# EAGLE design unoedge (EAGLE 6.5.0)
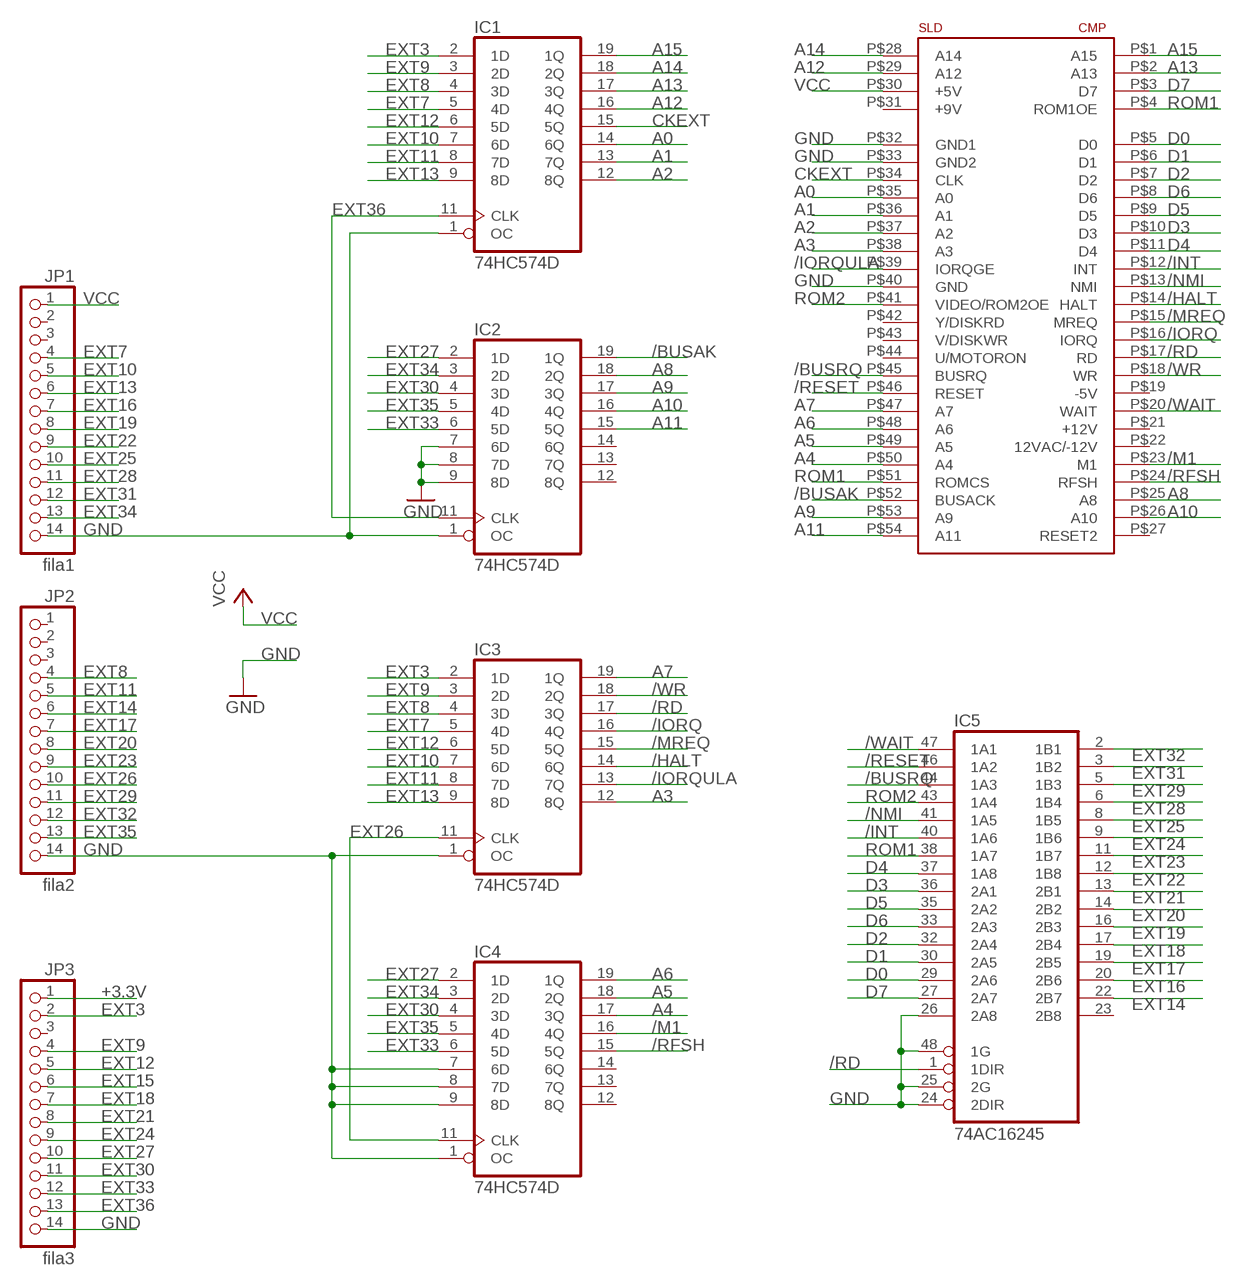
[diagram p0: schematic, sheet 1]

## Parts
IC1  74HC574D  [SO20W]
IC2  74HC574D  [SO20W]
IC3  74HC574D  [SO20W]
IC4  74HC574D  [SO20W]
IC5  74AC16245  [SSOP48DL]
JP1  fila1  PINHD-1X14  [1X14]
JP2  fila2  PINHD-1X14  [1X14]
JP3  fila3  PINHD-1X14  [1X14]
U$2  CONECTOR_EDGE_LADO_SPECTRUM  [CONECTOR_LADO_SPECTRUM]

## Nets
+3.3V: JP3.1
/BUSAK: IC2.19(1Q) U$2.P$52(BUSACK)
/BUSRQ: IC5.44(1A3) U$2.P$45(BUSRQ)
/HALT: IC3.14(6Q) U$2.P$14(HALT)
/INT: IC5.40(1A6) U$2.P$12(INT)
/IORQ: IC3.16(4Q) U$2.P$16(IORQ)
/IORQULA: IC3.13(7Q) U$2.P$39(IORQGE)
/M1: IC4.16(4Q) U$2.P$23(M1)
/MREQ: IC3.15(5Q) U$2.P$15(MREQ)
/NMI: IC5.41(1A5) U$2.P$13(NMI)
/RD: IC3.17(3Q) IC5.1(1DIR) U$2.P$17(RD)
/RESET: IC5.46(1A2) U$2.P$46(RESET)
/RFSH: IC4.15(5Q) U$2.P$24(RFSH)
/WAIT: IC5.47(1A1) U$2.P$20(WAIT)
/WR: IC3.18(2Q) U$2.P$18(WR)
A0: IC1.14(6Q) U$2.P$35(A0)
A1: IC1.13(7Q) U$2.P$36(A1)
A2: IC1.12(8Q) U$2.P$37(A2)
A3: IC3.12(8Q) U$2.P$38(A3)
A4: IC4.17(3Q) U$2.P$50(A4)
A5: IC4.18(2Q) U$2.P$49(A5)
A6: IC4.19(1Q) U$2.P$48(A6)
A7: IC3.19(1Q) U$2.P$47(A7)
A8: IC2.18(2Q) U$2.P$25(A8)
A9: IC2.17(3Q) U$2.P$53(A9)
A10: IC2.16(4Q) U$2.P$26(A10)
A11: IC2.15(5Q) U$2.P$54(A11)
A12: IC1.16(4Q) U$2.P$29(A12)
A13: IC1.17(3Q) U$2.P$2(A13)
A14: IC1.18(2Q) U$2.P$28(A14)
A15: IC1.19(1Q) U$2.P$1(A15)
CKEXT: IC1.15(5Q) U$2.P$34(CLK)
D0: IC5.29(2A6) U$2.P$5(D0)
D1: IC5.30(2A5) U$2.P$6(D1)
D2: IC5.32(2A4) U$2.P$7(D2)
D3: IC5.36(2A1) U$2.P$10(D3)
D4: IC5.37(1A8) U$2.P$11(D4)
D5: IC5.35(2A2) U$2.P$9(D5)
D6: IC5.33(2A3) U$2.P$8(D6)
D7: IC5.27(2A7) U$2.P$3(D7)
EXT3: IC1.2(1D) IC3.2(1D) JP3.2
EXT7: IC1.5(4D) IC3.5(4D) JP1.4
EXT8: IC1.4(3D) IC3.4(3D) JP2.4
EXT9: IC1.3(2D) IC3.3(2D) JP3.4
EXT10: IC1.7(6D) IC3.7(6D) JP1.5
EXT11: IC1.8(7D) IC3.8(7D) JP2.5
EXT12: IC1.6(5D) IC3.6(5D) JP3.5
EXT13: IC1.9(8D) IC3.9(8D) JP1.6
EXT14: IC5.22(2B7) JP2.6
EXT15: JP3.6
EXT16: IC5.20(2B6) JP1.7
EXT17: IC5.19(2B5) JP2.7
EXT18: IC5.17(2B4) JP3.7
EXT19: IC5.16(2B3) JP1.8
EXT20: IC5.14(2B2) JP2.8
EXT21: IC5.13(2B1) JP3.8
EXT22: IC5.12(1B8) JP1.9
EXT23: IC5.11(1B7) JP2.9
EXT24: IC5.9(1B6) JP3.9
EXT25: IC5.8(1B5) JP1.10
EXT26: IC3.11(CLK) IC4.11(CLK) JP2.10
EXT27: IC2.2(1D) IC4.2(1D) JP3.10
EXT28: IC5.6(1B4) JP1.11
EXT29: IC5.5(1B3) JP2.11
EXT30: IC2.4(3D) IC4.4(3D) JP3.11
EXT31: IC5.3(1B2) JP1.12
EXT32: IC5.2(1B1) JP2.12
EXT33: IC2.6(5D) IC4.6(5D) JP3.12
EXT34: IC2.3(2D) IC4.3(2D) JP1.13
EXT35: IC2.5(4D) IC4.5(4D) JP2.13
EXT36: IC1.11(CLK) IC2.11(CLK) JP3.13
GND: IC1.1(OC) IC2.1(OC) IC2.7(6D) IC2.8(7D) IC2.9(8D) IC3.1(OC) IC4.1(OC) IC4.7(6D) IC4.8(7D) IC4.9(8D) IC5.24(2DIR) IC5.25(2G) IC5.26(2A8) IC5.48(1G) JP1.14 JP2.14 JP3.14 U$2.P$32(GND1) U$2.P$33(GND2) U$2.P$40(GND)
ROM1: IC5.38(1A7) U$2.P$4(ROM1OE) U$2.P$51(ROMCS)
ROM2: IC5.43(1A4) U$2.P$41(VIDEO/ROM2OE)
VCC: JP1.1 U$2.P$30(+5V)
Unconnected: IC2.12(8Q) IC2.13(7Q) IC2.14(6Q) IC4.12(8Q) IC4.13(7Q) IC4.14(6Q) IC5.23(2B8) JP1.2 JP1.3 JP2.1 JP2.2 JP2.3 JP3.3 U$2.P$19(-5V) U$2.P$21(+12V) U$2.P$22(12VAC/-12V) U$2.P$27(RESET2) U$2.P$31(+9V) U$2.P$42(Y/DISKRD) U$2.P$43(V/DISKWR) U$2.P$44(U/MOTORON)

## Power pins joined to a net without a drawn wire
GND: IC1.10(GND) IC2.10(GND) IC3.10(GND) IC4.10(GND) IC5.4(GND) IC5.10(GND) IC5.15(GND) IC5.21(GND) IC5.28(GND) IC5.34(GND) IC5.39(GND) IC5.45(GND)
VCC: IC1.20(VCC) IC2.20(VCC) IC3.20(VCC) IC4.20(VCC) IC5.7(VCC) IC5.18(VCC) IC5.31(VCC) IC5.42(VCC)

## Library data of the parts
IC1-IC4 = 74xx-eu:74*574: 8-bit D type FLIP FLOP bus driver
IC5 = 74ac-logic:74AC16245: 16-bit BUS TRANSCEIVER, 3-state
JP1-JP3 = pinhead:PINHD-1X14: PIN HEADER
U$2 = zx_bus_connector_lado_spectrum:CONECTOR_EDGE_LADO_SPECTRUM

## Board
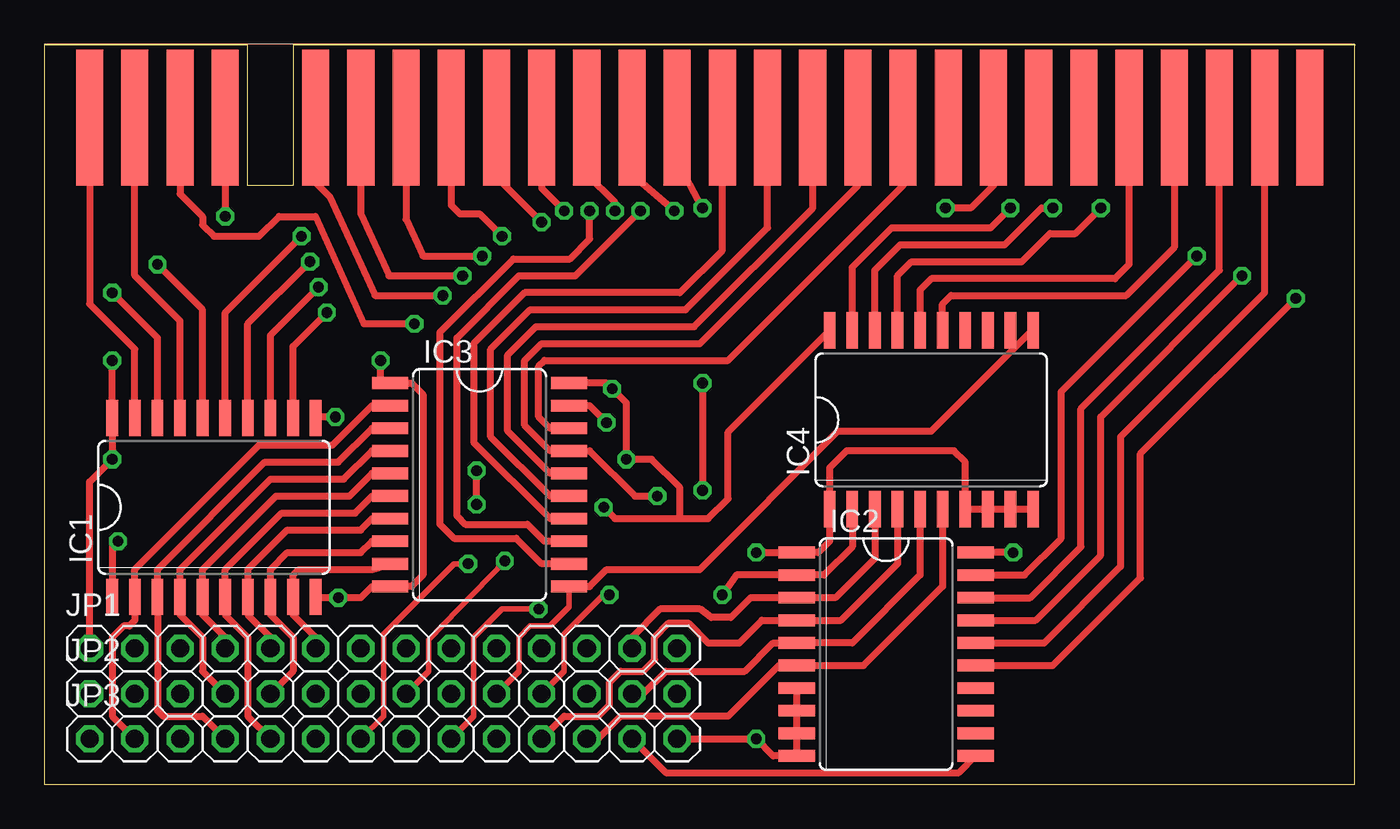
[diagram p1: board, top side]
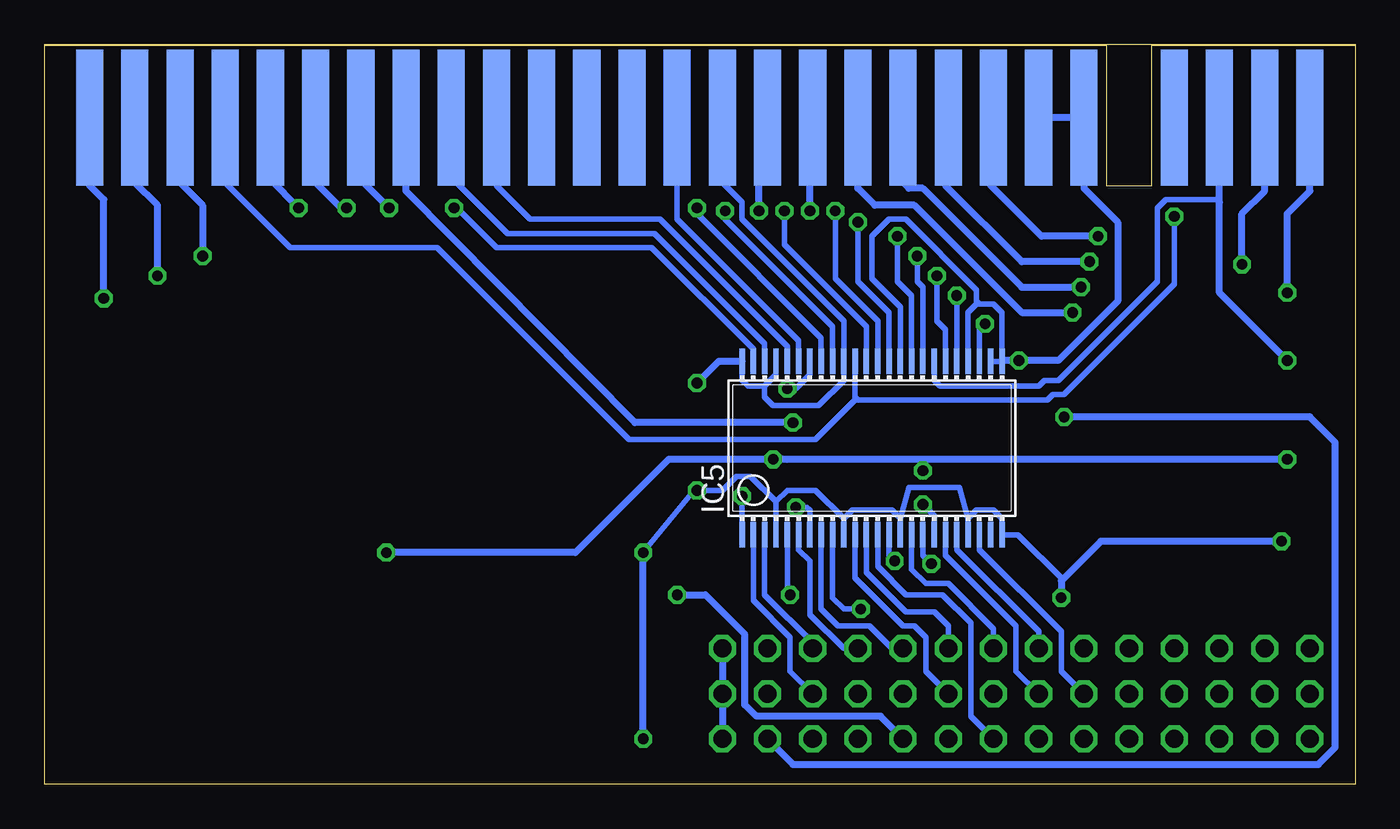
[diagram p2: board, bottom side, seen from below]

Size 73.66 x 41.58 mm. Coordinates in mm from the lower left corner, seen from the top.
Outline: 0,0 73.64,0 73.64,41.58 0,41.58 0,0
Copper layers (1*16): Top 0.035mm / dielectric 1.5mm / Bottom 0.035mm
Design rules "default": minimum track width 10mil, minimum drill 24mil, track to track 8mil, track to pad 8mil, pad to pad 8mil, via to via 8mil, smd to smd 8mil, copper to edge 40mil, drill to drill 8mil, minimum pad ring 10mil, minimum via ring 8mil, stop-mask expansion 4mil, vias tented up to drill 0mil, thermal gap 10mil

### Footprints (pad centres in the part's own frame; a part is rotated, then mirrored left to right if it is on the bottom)
SO20W = smd 0.66 x 2.032: 1 -5.715,-5.029; 2 -4.445,-5.029; 3 -3.175,-5.029; 4 -1.905,-5.029; 5 -0.635,-5.029; 6 0.635,-5.029; 7 1.905,-5.029; 8 3.175,-5.029; 9 4.445,-5.029; 10 5.715,-5.029; 11 5.715,5.029; 12 4.445,5.029; 13 3.175,5.029; 14 1.905,5.029; 15 0.635,5.029; 16 -0.635,5.029; 17 -1.905,5.029; 18 -3.175,5.029; 19 -4.445,5.029; 20 -5.715,5.029
SSOP48DL = smd 0.305 x 1.422: 1 -6.985,-4.877; 2 -6.35,-4.877; 3 -5.715,-4.877; 4 -5.08,-4.877; 5 -4.445,-4.877; 6 -3.81,-4.877; 7 -3.175,-4.877; 8 -2.54,-4.877; 9 -1.905,-4.877; 10 -1.27,-4.877; 11 -0.635,-4.877; 12 0,-4.877; 13 0.635,-4.877; 14 1.27,-4.877; 15 1.905,-4.877; 16 2.54,-4.877; 17 3.175,-4.877; 18 3.81,-4.877; 19 4.445,-4.877; 20 5.08,-4.877; 21 5.715,-4.877; 22 6.35,-4.877; 23 6.985,-4.877; 24 7.62,-4.877; 25 7.62,4.877; 26 6.985,4.877; 27 6.35,4.877; 28 5.715,4.877; 29 5.08,4.877; 30 4.445,4.877; 31 3.81,4.877; 32 3.175,4.877; 33 2.54,4.877; 34 1.905,4.877; 35 1.27,4.877; 36 0.635,4.877; 37 0,4.877; 38 -0.635,4.877; 39 -1.27,4.877; 40 -1.905,4.877; 41 -2.54,4.877; 42 -3.175,4.877; 43 -3.81,4.877; 44 -4.445,4.877; 45 -5.08,4.877; 46 -5.715,4.877; 47 -6.35,4.877; 48 -6.985,4.877
1X14 = drill 1.016 octagon: 1 -16.51,0; 2 -13.97,0; 3 -11.43,0; 4 -8.89,0; 5 -6.35,0; 6 -3.81,0; 7 -1.27,0; 8 1.27,0; 9 3.81,0; 10 6.35,0; 11 8.89,0; 12 11.43,0; 13 13.97,0; 14 16.51,0
CONECTOR_LADO_SPECTRUM = smd 7.62 x 1.524: P$1 2.54,2.54; P$2 2.54,0; P$3 2.54,-2.54; P$4 2.54,-5.08; P$5 2.54,-10.16; P$6 2.54,-12.7; P$7 2.54,-15.24; P$8 2.54,-17.78; P$9 2.54,-20.32; P$10 2.54,-22.86; P$11 2.54,-25.4; P$12 2.54,-27.94; P$13 2.54,-30.48; P$14 2.54,-33.02; P$15 2.54,-35.56; P$16 2.54,-38.1; P$17 2.54,-40.64; P$18 2.54,-43.18; P$19 2.54,-45.72; P$20 2.54,-48.26; P$21 2.54,-50.8; P$22 2.54,-53.34; P$23 2.54,-55.88; P$24 2.54,-58.42; P$25 2.54,-60.96; P$26 2.54,-63.5; P$27 2.54,-66.04 | smd 7.62 x 1.524 bottom: P$28 2.54,2.54; P$29 2.54,0; P$30 2.54,-2.54; P$31 2.54,-5.08; P$32 2.54,-10.16; P$33 2.54,-12.7; P$34 2.54,-15.24; P$35 2.54,-17.78; P$36 2.54,-20.32; P$37 2.54,-22.86; P$38 2.54,-25.4; P$39 2.54,-27.94; P$40 2.54,-30.48; P$41 2.54,-33.02; P$42 2.54,-35.56; P$43 2.54,-38.1; P$44 2.54,-40.64; P$45 2.54,-43.18; P$46 2.54,-45.72; P$47 2.54,-48.26; P$48 2.54,-50.8; P$49 2.54,-53.34; P$50 2.54,-55.88; P$51 2.54,-58.42; P$52 2.54,-60.96; P$53 2.54,-63.5; P$54 2.54,-66.04

### Placement (x,y rotation side)
IC1  9.53,15.56 0 top
IC2  47.31,7.3 270 top
IC3  24.45,16.83 270 top
IC4  49.85,20.48 0 top
IC5  27.46,18.89 0 bottom
JP1  19.05,7.62 0 top
JP2  19.05,5.08 0 top
JP3  19.05,2.54 0 top
U$2  5.08,34.92 90 top

### Tracks (layer width: path | path; a pad name or v marks a point on that pad's centre or on a via)
/BUSAK  (via drill 0.6)
  Top 0.406: IC2.19 55.09,11.75 57.15,13.81 57.15,22.07 v64.77,29.69
  Bottom 0.406: U$2.P$52 66.04,33.81 64.77,32.54 v64.77,29.69
/BUSRQ
  Bottom 0.305: U$2.P$45 48.26,33.66 46.35,31.75 39.05,31.75 31.91,24.61 IC5.44
/HALT
  Top 0.406: IC3.14 28.42,14.92 24.13,19.21 24.13,24.77 26.99,27.62 35.72,27.62 38.1,30 U$2.P$14
/INT  (via drill 0.6)
  Top 0.406: v35.4,32.23 33.02,34.29 U$2.P$12
  Bottom 0.305: IC5.40 29.37,25.72 35.4,31.75 v35.4,32.23
/IORQ
  Top 0.406: IC3.16 28.42,17.46 26.04,19.84 26.04,24.13 27.62,25.72 36.51,25.72 43.18,32.38 U$2.P$16
/IORQULA  (via drill 0.6)
  Top 0.406: IC3.13 28.1,13.65 27.15,14.61 23.65,14.61 23.18,15.08 23.18,25.08 26.67,28.57 29.84,28.57 v33.5,32.23
  Bottom 0.406: v33.5,32.23 33.5,36.99 U$2.P$39
/M1
  Top 0.406: U$2.P$23 60.96,29.21 60.17,28.42 49.85,28.42 49.21,27.78 IC4.16
/MREQ
  Top 0.406: IC3.15 28.42,16.19 25.08,19.53 25.08,24.45 27.3,26.67 36.04,26.67 40.64,31.27 U$2.P$15
/NMI  (via drill 0.6)
  Top 0.406: v36.99,32.38 35.56,35.08 U$2.P$13
  Bottom 0.305: v36.99,32.38 36.99,32.07 30,25.08 IC5.41
/RD  (via drill 0.6)
  Top 0.406: U$2.P$17 45.72,33.66 36.83,24.77 27.94,24.77 26.99,23.81 26.99,20.16 28.42,18.73 IC3.17 30.64,18.73 33.18,16.19 v34.45,16.19
  Bottom 0.305: v34.45,16.19 IC5.1
/RESET
  Bottom 0.305: U$2.P$46 50.8,34.13 47.62,30.96 39.37,30.96 33.18,24.77 IC5.46
/RFSH
  Top 0.406: U$2.P$24 63.5,30.16 60.8,27.46 50.96,27.46 50.48,26.99 IC4.15
/WAIT  (via drill 0.6)
  Top 0.406: U$2.P$20 53.34,33.66 52.07,32.38 v50.64,32.38
  Bottom 0.305: v50.64,32.38 50.32,32.23 48.26,30.16 39.53,30.16 33.81,24.45 IC5.47
/WR
  Top 0.406: IC3.18 28.42,20 27.78,20.64 27.78,23.5 28.1,23.81 38.42,23.81 48.26,33.66 U$2.P$18
A0  (via drill 0.6)
  Top 0.406: IC1.14 11.43,25.88 v14.92,29.37
  Bottom 0.406: U$2.P$35 23.02,37.31 23.02,33.66 18.73,29.37 v14.92,29.37
A1  (via drill 0.6)
  Top 0.406: IC1.13 12.7,25.24 v15.4,27.94
  Bottom 0.406: U$2.P$36 25.56,37.31 25.56,33.97 25.08,33.5 24.29,33.5 18.73,27.94 v15.4,27.94
A2  (via drill 0.6)
  Top 0.406: IC1.12 13.97,24.61 v15.88,26.51
  Bottom 0.406: U$2.P$37 27.94,33.5 26.99,32.54 24.77,32.54 18.73,26.51 v15.88,26.51
A3  (via drill 0.6)
  Top 0.406: IC3.12 27.94,12.38 26.51,13.81 23.02,13.81 22.23,14.61 22.23,25.4 26.35,29.53 29.53,29.53 30.64,30.64 v30.64,32.23
  Bottom 0.406: v30.64,32.23 30.64,37.31 U$2.P$38
A4  (via drill 0.6)
  Top 0.406: IC4.17 47.94,28.57 48.74,29.37 54.93,29.37 56.52,30.96 57.94,30.96 v59.37,32.38
  Bottom 0.406: v59.37,32.38 60.96,33.97 U$2.P$50
A5  (via drill 0.6)
  Top 0.406: IC4.18 46.67,28.89 48.1,30.32 53.98,30.32 56.04,32.38 v56.67,32.38
  Bottom 0.406: v56.67,32.38 56.99,32.38 58.42,33.81 U$2.P$49
A6  (via drill 0.6)
  Top 0.406: IC4.19 45.4,29.05 47.62,31.27 53.18,31.27 v54.29,32.38
  Bottom 0.406: v54.29,32.38 55.88,33.97 U$2.P$48
A7  (via drill 0.6)
  Top 0.406: IC3.19 30.64,21.27 v31.59,20.32
  Bottom 0.406: v31.59,20.32 40.48,20.32 53.34,33.34 U$2.P$47
A8
  Top 0.406: IC2.18 55.4,10.48 58.26,13.34 58.26,21.11 66.04,28.89 U$2.P$25
A9  (via drill 0.6)
  Top 0.406: IC2.17 55.72,9.21 59.37,12.86 59.37,20.64 v67.31,28.57
  Bottom 0.406: v67.31,28.57 67.31,32.54 68.58,33.81 U$2.P$53
A10
  Top 0.406: IC2.16 56.2,7.94 60.48,12.22 60.48,19.53 68.58,27.62 U$2.P$26
A11  (via drill 0.6)
  Top 0.406: IC2.15 56.67,6.67 61.59,11.59 61.59,18.57 v70.33,27.3
  Bottom 0.406: v70.33,27.3 70.33,32.86 71.12,33.66 U$2.P$54
A12  (via drill 0.6)
  Top 0.406: IC1.16 8.89,26.67 v6.35,29.21
  Bottom 0.406: v6.35,29.21 6.35,32.07 5.08,33.34 U$2.P$29
A13
  Top 0.406: IC1.17 7.62,26.04 5.08,28.57 U$2.P$2
A14  (via drill 0.6)
  Top 0.406: IC1.18 6.35,25.08 v3.81,27.62
  Bottom 0.406: v3.81,27.62 3.81,32.07 2.54,33.34 U$2.P$28
A15
  Top 0.406: IC1.19 5.08,24.45 2.54,26.99 U$2.P$1
CKEXT  (via drill 0.6)
  Top 0.406: IC1.15 10.16,26.51 v14.45,30.8
  Bottom 0.406: v14.45,30.8 17.62,30.8 20.48,33.66 20.48,37.31 U$2.P$34
D0  (via drill 0.6)
  Top 0.406: U$2.P$5 15.24,33.81 16.03,33.02 18.57,27.46 v22.38,27.46
  Bottom 0.305: v22.38,27.46 IC5.29
D1  (via drill 0.6)
  Top 0.406: U$2.P$6 17.78,32.07 19.37,28.57 v23.5,28.57
  Bottom 0.305: v23.5,28.57 23.5,26.04 23.02,25.56 IC5.30
D2  (via drill 0.6)
  Top 0.406: U$2.P$7 20.32,31.75 21.27,29.69 v24.61,29.69
  Bottom 0.305: v24.61,29.69 24.61,28.26 24.29,27.94 IC5.32
D3  (via drill 0.6)
  Top 0.406: U$2.P$10 27.94,33.5 v29.21,32.23
  Bottom 0.305: IC5.36 26.83,26.04 29.21,28.42 v29.21,32.23
D4  (via drill 0.6)
  Top 0.406: U$2.P$11 30.48,34.29 32.07,32.7 v32.07,32.23
  Bottom 0.305: v32.07,32.23 32.07,30.32 27.46,25.72 IC5.37
D5  (via drill 0.6)
  Top 0.406: U$2.P$9 25.4,34.13 v27.94,31.59
  Bottom 0.305: v27.94,31.59 27.94,28.26 26.19,26.51 IC5.35
D6  (via drill 0.6)
  Top 0.406: U$2.P$8 22.86,32.54 23.34,32.07 24.45,32.07 v25.72,30.8
  Bottom 0.305: IC5.33 24.92,27.46 25.72,28.26 v25.72,30.8
D7  (via drill 0.6)
  Top 0.406: U$2.P$3 7.62,33.18 8.89,31.91 8.89,31.43 9.53,30.8 12.06,30.8 13.18,31.91 15.24,31.91 17.94,25.88 v20.8,25.88
  Bottom 0.305: v20.8,25.88 21.11,25.56 IC5.27
EXT3
  Top 0.406: JP3.2 3.81,3.81 3.81,8.26 4.45,8.89 4.76,8.89 5.08,9.21 IC1.2 5.08,12.06 12.06,19.05 16.19,19.05 18.41,21.27 IC3.2
EXT7
  Top 0.406: JP1.4 10.16,8.26 8.89,9.53 IC1.5 8.89,12.06 13.02,16.19 17.14,16.19 18.41,17.46 IC3.5 20,17.46
EXT8
  Top 0.406: JP2.4 8.89,6.35 8.89,8.26 7.62,9.53 IC1.4 7.62,12.06 12.7,17.14 16.83,17.14 18.41,18.73 IC3.4
EXT9
  Top 0.406: JP3.4 8.89,3.81 6.67,3.81 6.35,4.13 IC1.3 6.35,12.06 12.38,18.1 16.51,18.1 18.41,20 IC3.3
EXT10
  Top 0.406: JP1.5 12.7,8.26 11.43,9.53 IC1.7 11.43,12.06 13.65,14.29 17.78,14.29 18.41,14.92 IC3.7
EXT11
  Top 0.406: JP2.5 13.97,6.35 13.97,8.26 12.7,9.53 IC1.8 12.7,12.06 13.65,13.02 17.78,13.02 18.41,13.65 IC3.8
EXT12
  Top 0.406: JP3.5 11.43,3.81 11.43,8.26 10.16,9.53 IC1.6 10.16,12.06 13.34,15.24 17.46,15.24 18.41,16.19 IC3.6
EXT13
  Top 0.406: JP1.6 15.24,8.26 13.97,9.53 IC1.9 13.97,11.75 14.29,12.06 18.41,12.06 IC3.9
EXT14
  Bottom 0.305: JP2.6 16.51,6.35 16.51,8.57 21.11,13.18 IC5.22
EXT16
  Bottom 0.305: JP1.7 17.78,8.57 22.38,13.18 IC5.20
EXT17
  Bottom 0.305: JP2.7 19.05,6.35 19.05,8.89 23.02,12.86 IC5.19
EXT18  (via drill 0.6)
  Top 0.305: JP3.7 19.05,3.81 19.05,8.41 23.02,12.38 v23.81,12.38
  Bottom 0.305: v23.81,12.38 24.29,12.86 IC5.17
EXT19
  Bottom 0.305: JP1.8 20.32,8.73 22.86,11.27 24.13,11.27 24.92,12.06 IC5.16
EXT20  (via drill 0.6)
  Top 0.305: JP2.8 21.59,6.35 21.59,8.1 v25.88,12.54
  Bottom 0.305: v25.88,12.54 26.19,12.7 IC5.14
EXT21
  Bottom 0.305: JP3.8 21.59,3.81 21.59,9.05 23.18,10.64 25.24,10.64 26.83,12.22 IC5.13
EXT22
  Bottom 0.305: IC5.12 27.46,11.91 25.24,9.68 23.65,9.68 22.86,8.89 JP1.9
EXT23
  Bottom 0.305: JP2.9 24.13,6.35 24.13,8.26 24.77,8.89 25.4,8.89 28.1,11.59 IC5.11
EXT24  (via drill 0.6)
  Top 0.305: v27.78,9.84 25.72,9.84 24.13,8.26 24.13,3.81 JP3.9
  Bottom 0.305: IC5.9 29.37,10.48 28.73,9.84 v27.78,9.84
EXT25
  Bottom 0.305: JP1.10 26.04,7.62 27.3,8.89 29.05,8.89 30,9.84 IC5.8
EXT26
  Top 0.305: IC3.11 29.48,9.95 28.42,8.89 27.3,8.89 26.67,8.26 26.67,6.35 JP2.10
  Top 0.406: IC3.11 30.64,11.11 31.59,12.06 36.83,12.06 44.61,19.84 49.85,19.84 55.56,25.56 IC4.11
EXT27  (via drill 0.6)
  Top 0.406: IC4.2 45.4,13.34 43.81,11.75 IC2.2 38.89,11.75 v38.1,10.64
  Bottom 0.406: v38.1,10.64 36.51,10.64 34.29,8.41 34.29,4.45 33.66,3.81 26.67,3.81 JP3.10
EXT28
  Bottom 0.305: JP1.11 28.73,7.62 30.64,9.53 30.64,12.54 31.27,13.18 IC5.6
EXT29  (via drill 0.6)
  Top 0.305: JP2.11 29.21,6.35 29.21,8.41 31.43,10.64 v31.75,10.64
  Bottom 0.305: v31.75,10.64 31.91,10.79 IC5.5
EXT30
  Top 0.406: IC4.4 47.94,12.38 44.77,9.21 IC2.4 40.32,9.21 39.05,7.94 37.31,7.94 36.2,9.05 35.08,9.05 34.29,8.26 34.29,6.99 33.66,6.35 32.38,6.35 31.75,5.71 31.75,4.45 31.11,3.81 29.21,3.81 JP3.11
EXT31
  Bottom 0.305: JP1.12 30.48,7.94 33.18,10.64 IC5.3
EXT32
  Bottom 0.305: JP2.12 31.75,6.35 31.75,8.26 33.81,10.32 IC5.2
EXT33
  Top 0.406: IC4.6 50.48,11.11 46.04,6.67 IC2.6 41.27,6.67 38.42,3.81 32.38,3.81 31.11,2.54 JP3.12
EXT34
  Top 0.406: IC4.3 46.67,12.7 44.45,10.48 IC2.3 39.69,10.48 38.58,9.37 37.47,9.37 36.83,9.84 34.61,9.84 33.02,8.26 JP1.13
EXT35
  Top 0.406: IC4.5 49.21,11.75 45.4,7.94 IC2.5 40.96,7.94 39.37,6.35 34.92,6.35 33.66,5.08 JP2.13
EXT36  (via drill 0.6)
  Top 0.406: JP3.13 34.92,0.64 51.38,0.64 IC2.11 | v16.35,20.64 15.29,20.64 IC1.11
  Bottom 0.406: JP3.13 31.59,1.11 2.06,1.11 1.11,2.06 1.11,19.21 2.54,20.64 v16.35,20.64
GND  (via drill 0.6)
  Top 0.406: IC4.10 IC4.9 IC4.8 IC4.7 51.75,18.1 51.12,18.73 45.09,18.73 44.13,17.78 IC4.1 44.13,13.65 43.5,13.02 IC2.1 v40.01,13.02 | IC2.7 IC2.8 IC2.9 IC2.10 40.96,1.59 v40.01,2.54 JP3.14 | IC1.10 15.29,10.48 v16.51,10.48 17.78,10.48 18.41,11.11 IC3.10 20.64,11.11 21.27,11.75 21.27,21.91 20.64,22.54 IC3.1 18.89,22.54 v18.89,23.81 | v4.13,13.65 3.81,13.34 IC1.1 | v36.99,22.54 v36.99,16.51
  Bottom 0.305: U$2.P$40 35.56,33.81 34.45,32.7 34.45,31.75 28.73,26.04 IC5.39 28.73,22.7 30.16,21.27 32.7,21.27 33.18,21.75 33.18,22.38 | 16.43,11.51 18.94,14.01 IC5.24 19.84,14.92 20.32,15.4 21.27,15.4 21.75,14.92 | 21.75,14.92 IC5.21 | IC5.15 25.56,14.92 | 25.56,14.92 26.04,15.4 28.26,15.4 28.73,14.92 | 28.73,14.92 IC5.10 | 32.54,15.88 31.91,16.51 30.32,16.51 28.73,14.92 | IC5.4 32.54,15.88 | 32.54,15.88 33.97,17.3 34.77,17.3 35.56,16.51 36.83,16.51 | v36.99,16.51 37.15,16.51 v40.01,13.02 | IC5.48 34.45,22.7 34.13,22.38 33.18,22.38 | 33.18,22.38 32.54,23.02 IC5.45 | IC5.26 IC5.25 19.84,26.51 20.32,26.99 21.11,26.99 | IC5.28 21.75,26.51 21.27,26.99 21.11,26.99 | IC5.34 25.56,26.83 27.15,28.42 27.15,30.8 26.19,31.75 25.24,31.75 21.27,27.78 21.27,27.15 21.11,26.99 | 21.75,14.92 22.23,16.67 25.08,16.67 25.56,14.92
  Bottom 0.406: U$2.P$33 U$2.P$32 15.24,33.5 13.34,31.59 13.34,27.15 16.67,23.81 v18.89,23.81 19.8,23.81 IC5.25 | v4.13,13.65 14.29,13.65 16.43,11.51 16.51,11.43 v16.51,10.48 | v40.01,2.54 v40.01,13.02 | JP1.14 JP2.14 JP3.14 | IC5.48 35.76,23.77 v36.99,22.54 | v36.99,16.51 36.83,16.51
ROM1  (via drill 0.6)
  Top 0.406: U$2.P$4 v10.16,31.91
  Bottom 0.305: U$2.P$51 63.5,33.81 59.85,30.16 51.59,30.16 40.8,19.37 30.32,19.37 28.1,21.59 28.1,21.75 | 28.1,21.75 IC5.38 | v10.16,31.91 10.16,28.1 16.35,21.91 16.99,21.91 17.3,21.59 27.94,21.59 28.1,21.75
ROM2
  Bottom 0.305: U$2.P$41 38.1,31.75 31.27,24.92 IC5.43
VCC  (via drill 0.6)
  Top 0.406: v3.81,23.81 IC1.20 v3.81,18.26 2.54,16.99 JP1.1 | 52.39,13.07 IC2.20 v54.45,13.02 | IC3.20 31.59,22.54 v31.91,22.23 32.7,21.43 v32.7,18.26 34.13,18.26 35.72,16.67 35.72,14.92 | v31.43,15.56 32.07,14.92 35.72,14.92 | v24.29,15.72 v24.29,17.62 | 35.72,14.92 37.31,14.92 38.42,16.03 38.42,19.79 IC4.20
  Bottom 0.305: v31.91,22.23 31.43,22.23 30.64,23.02 IC5.42 | IC5.7 30.64,15.4 30.8,15.56 v31.43,15.56 | IC5.31 23.65,22.7 23.34,22.38 17.78,22.38 17.46,22.7 16.67,22.7 11.11,28.26 11.11,32.38 10.64,32.86 7.78,32.86 7.62,32.7 | IC5.18 23.65,15.08 v24.29,15.72
  Bottom 0.406: v3.81,23.81 7.62,27.62 7.62,32.7 U$2.P$30 | v3.81,18.26 24.13,18.26 | 24.13,18.26 v32.7,18.26 | v32.7,18.26 31.91,18.26 32.7,18.41 v32.7,18.26 | v32.7,18.26 38.58,18.26 43.81,13.02 v54.45,13.02 | v24.29,17.62 24.29,18.1 24.13,18.26